# EasyEDA schematic CANViaRJ45AdapterBoard.json
TITLE: Sheet_1; REV: 1.0; Date: 2023-11-26; Sheet: 1/1; Company: Your Company
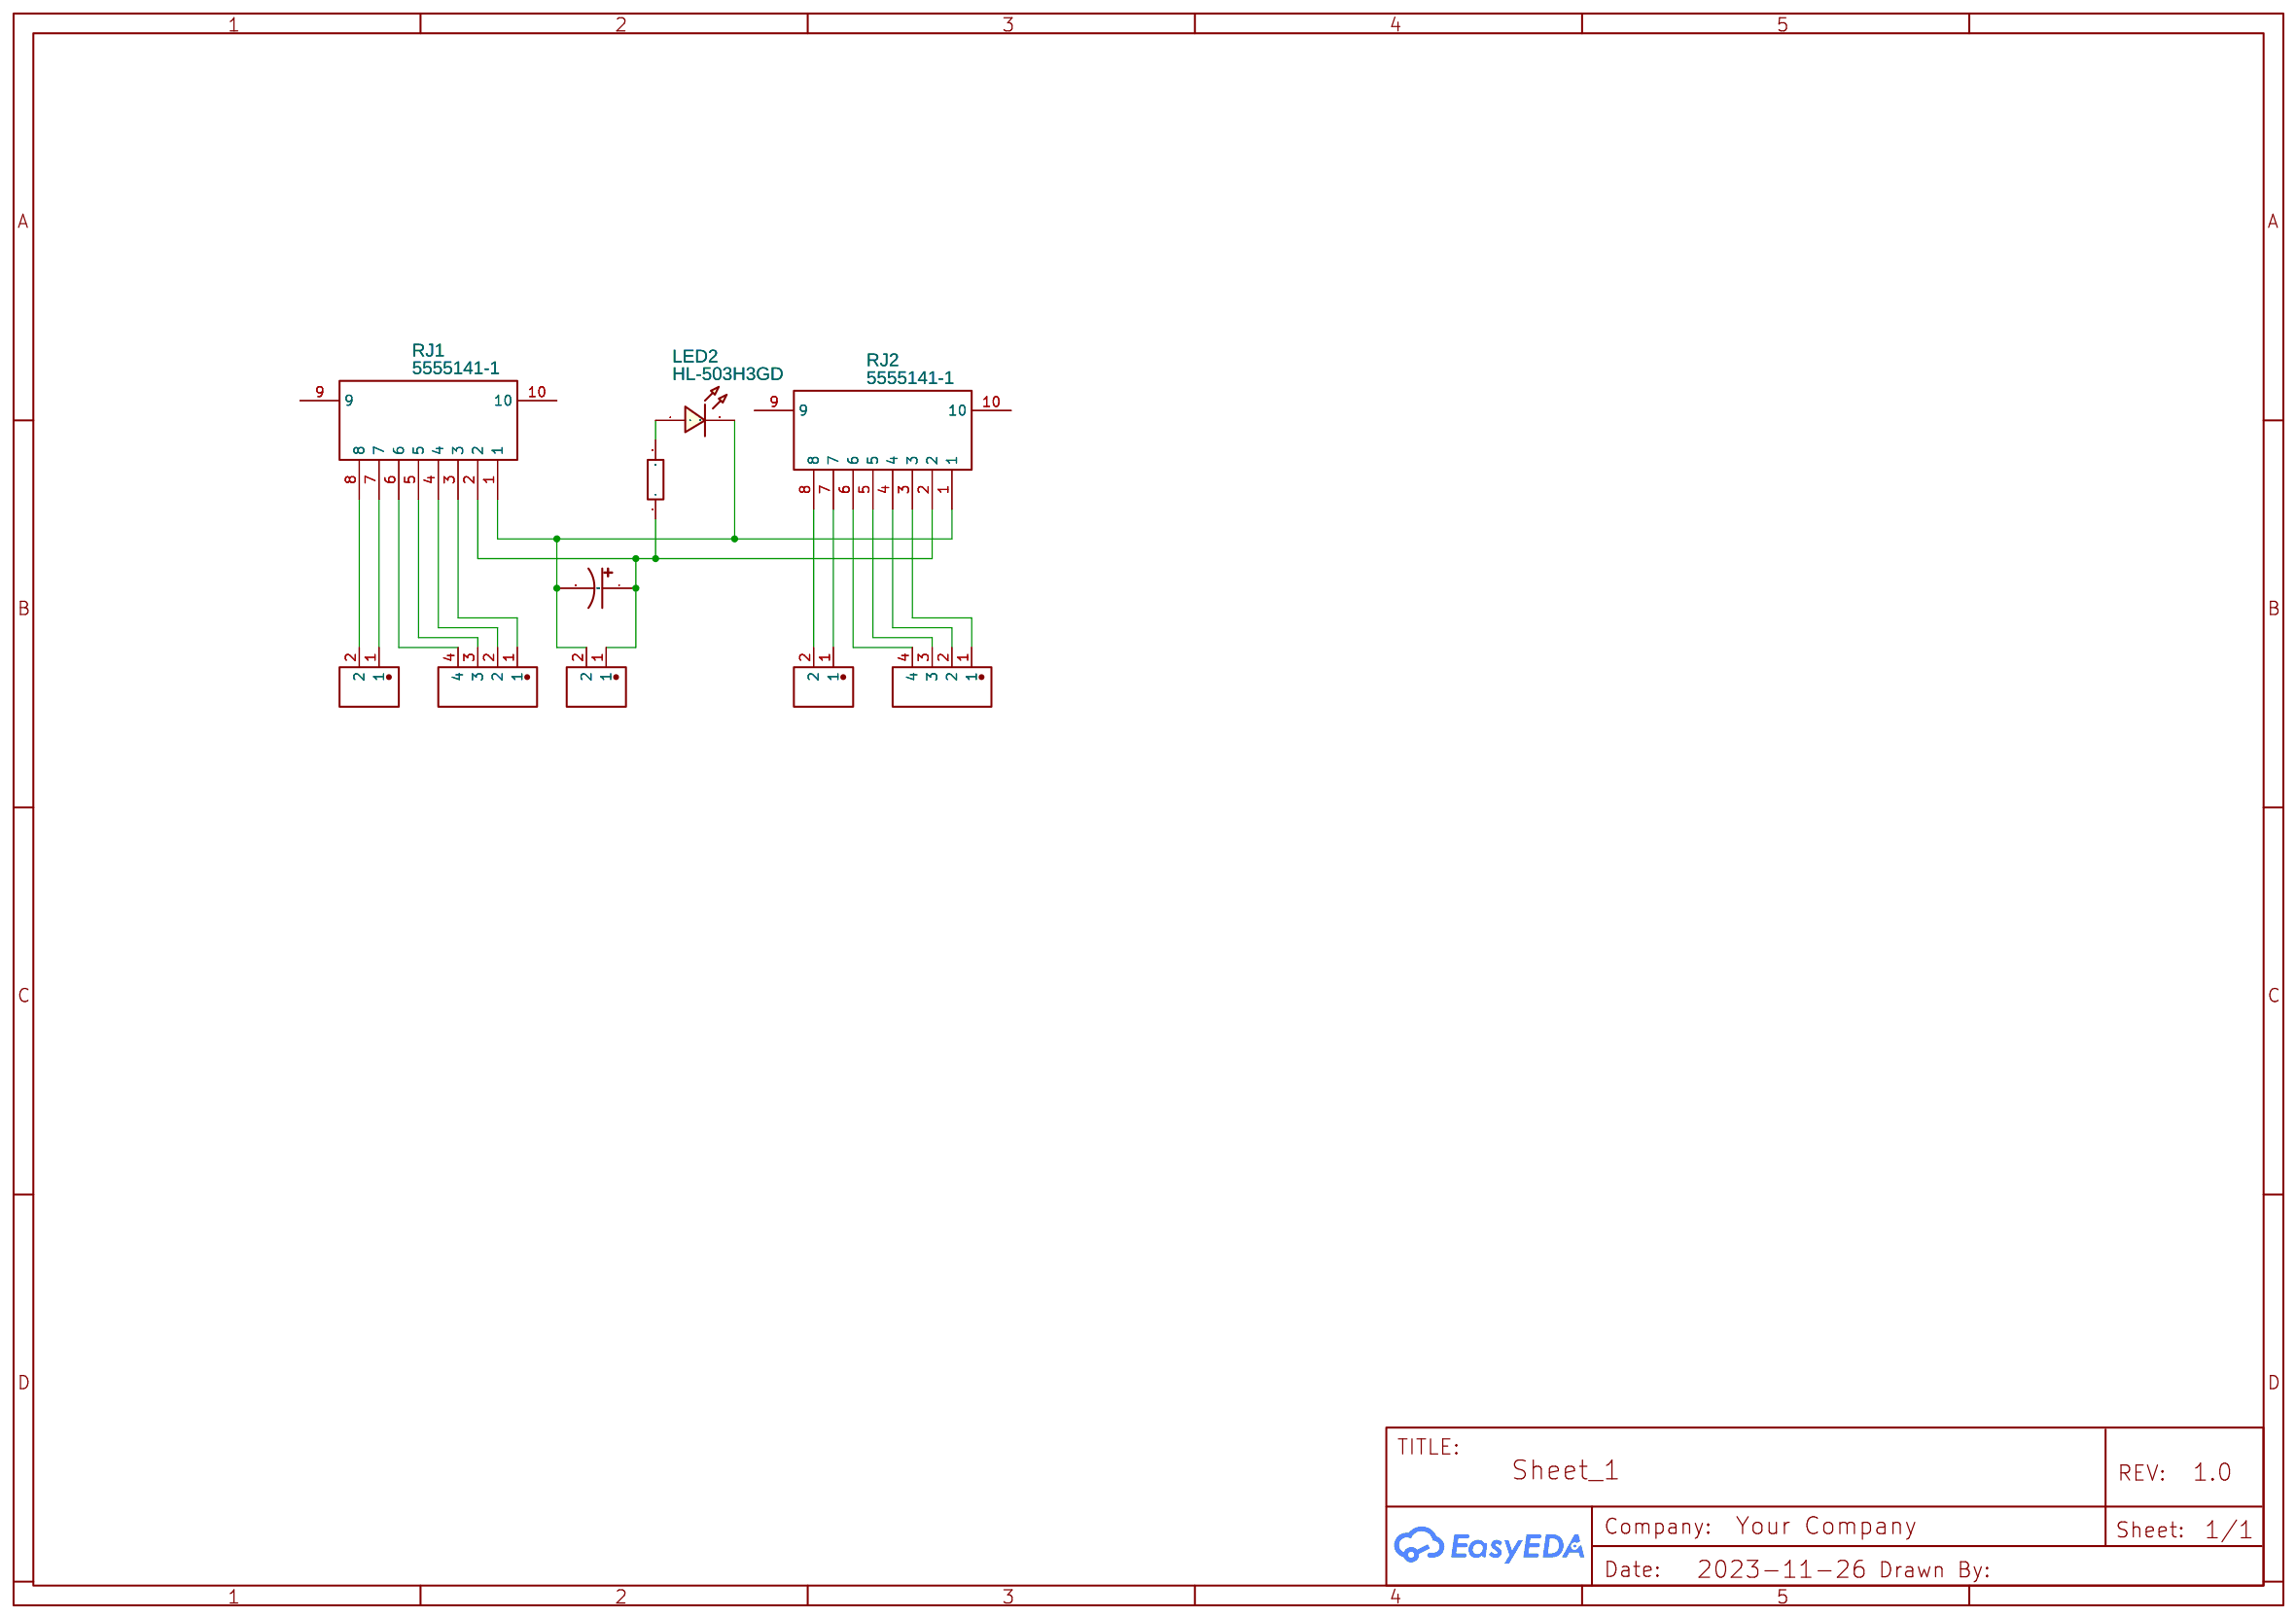
[diagram p0: schematic sheet]

## Parts
C1  1000uF  [CAP-TH_BD8.0-P3.50-D0.6-FD]
CN1  XY111B-5.08-2P  [CONN-TH_XY111B-5.08-2P]
CN2  XY111B-5.08-2P  [CONN-TH_XY111B-5.08-2P]
CN3  XY111B-5.08-2P  [CONN-TH_XY111B-5.08-2P]
CN4  KF243A-5.0-4P  [CONN-TH_4P-P5.00_KF243A-5.0-4P]
CN5  KF243A-5.0-4P  [CONN-TH_4P-P5.00_KF243A-5.0-4P]
LED2  HL-503H3GD  [LED-TH_BD5.0-P2.54-FD]
RJ1  5555141-1  [RJ45-TH_5555141-1]
RJ2  5555141-1  [RJ45-TH_5555141-1]
U1  600Ω  [RES-TH_BD4.5-L11.0-P15.00-D0.7]

## Library data of the parts
C1 = GF1C102MF160A00CV0: Contributor: LCSC; Supplier: LCSC; Supplier Part: C190874; Manufacturer: HUAWEI(华威集团); JLCPCB Part Class: Extended Part; link: https://lcsc.com/eda_search?q=C190874&%26type=1&ref=editor; Package Display: No
CN1-CN3 = XY111B-5.08-2P: Contributor: LCSC; Supplier: LCSC; Supplier Part: C784924; Manufacturer: XINLAIYA(新莱亚); JLCPCB Part Class: Extended Part; link: https://lcsc.com/eda_search?q=C784924&%26type=1&ref=editor
CN4 CN5 = KF243A-5.0-4P: Contributor: LCSC; Supplier: LCSC; Supplier Part: C475214; Manufacturer: KEFA(科发); JLCPCB Part Class: Extended Part; link: https://lcsc.com/eda_search?q=C475214&%26type=1&ref=editor
LED2 = HL-503H3GD: Contributor: LCSC; Supplier: LCSC; Supplier Part: C568941; Manufacturer: HONGLITRONIC(鸿利光电); JLCPCB Part Class: Extended Part; link: https://lcsc.com/eda_search?q=C568941&%26type=1&ref=editor
RJ1 RJ2 = 5555141-1: Contributor: LCSC; Supplier: LCSC; Supplier Part: C125071; Manufacturer: TE Connectivity(美国泰科); JLCPCB Part Class: Extended Part; link: https://lcsc.com/eda_search?q=C125071&%26type=1&ref=editor
U1 = MO1W-600Ω±5%-6T63: Contributor: LCSC; Supplier: LCSC; Supplier Part: C601838; Manufacturer: VO(翔胜); JLCPCB Part Class: Extended Part; link: https://lcsc.com/eda_search?q=C601838&%26type=1&ref=editor

## Nets
Net-(C1-1): C1.1 CN3.1 RJ1.2 RJ2.2 U1.1
Net-(C1-2): C1.2 CN3.2 LED2.2 RJ1.1 RJ2.1
Net-(CN1-1): CN1.1 RJ1.7
Net-(CN1-2): CN1.2 RJ1.8
Net-(CN2-1): CN2.1 RJ2.7
Net-(CN2-2): CN2.2 RJ2.8
Net-(CN4-1): CN4.1 RJ1.3
Net-(CN4-2): CN4.2 RJ1.4
Net-(CN4-3): CN4.3 RJ1.5
Net-(CN4-4): CN4.4 RJ1.6
Net-(CN5-1): CN5.1 RJ2.3
Net-(CN5-2): CN5.2 RJ2.4
Net-(CN5-3): CN5.3 RJ2.5
Net-(CN5-4): CN5.4 RJ2.6
Net-(LED2-1): LED2.1 U1.2

Not connected (* = marked no-connect by the designer): RJ1 9 10; RJ2 9 10
